# EAGLE design tlc (EAGLE 5.11)
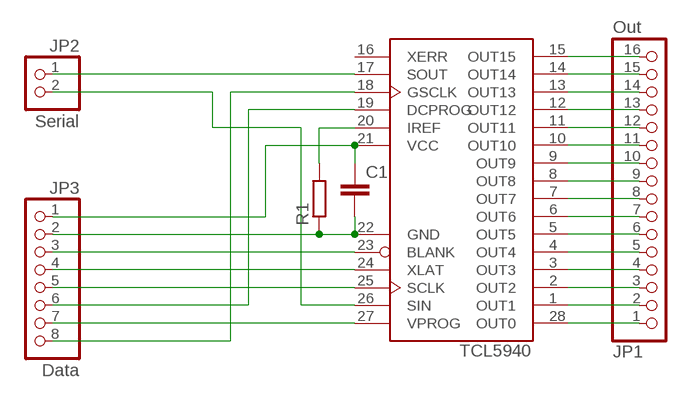
[diagram p0: schematic, sheet 1]

## Parts
C1  C-EU025-024X044  [C025-024X044]
IC1  TCL5940  [DIP28]
JP1  Out  PINHD-1X16  [1X16]
JP2  Serial  PINHD-1X2  [1X02]
JP3  Data  PINHD-1X8  [1X08]
R1  R-EU_0207/2V  [0207/2V]

## Nets
N$1: IC1.28(OUT0) JP1.1
N$2: IC1.1(OUT1) JP1.2
N$3: IC1.2(OUT2) JP1.3
N$4: IC1.3(OUT3) JP1.4
N$5: IC1.4(OUT4) JP1.5
N$6: IC1.5(OUT5) JP1.6
N$7: IC1.6(OUT6) JP1.7
N$8: IC1.7(OUT7) JP1.8
N$9: IC1.8(OUT8) JP1.9
N$10: IC1.9(OUT9) JP1.10
N$11: IC1.10(OUT10) JP1.11
N$12: IC1.11(OUT11) JP1.12
N$13: IC1.12(OUT12) JP1.13
N$14: IC1.13(OUT13) JP1.14
N$15: IC1.14(OUT14) JP1.15
N$16: IC1.15(OUT15) JP1.16
N$17: IC1.17(SOUT) JP2.1
N$18: IC1.26(SIN) JP2.2
N$19: C1.1 IC1.21(VCC) JP3.1
N$20: C1.2 IC1.22(GND) JP3.2 R1.1
N$21: IC1.23(BLANK) JP3.3
N$22: IC1.24(XLAT) JP3.4
N$23: IC1.25(SCLK) JP3.5
N$24: IC1.27(VPROG) JP3.7
N$25: IC1.18(GSCLK) JP3.8
N$26: IC1.19(DCPROG) JP3.6
N$27: IC1.20(IREF) R1.2
Unconnected: IC1.16(XERR)

## Library data of the parts
C1 = rcl:C-EU: CAPACITOR, European symbol
IC1 = tcl5940:TCL5940: 16-Channel 12-Bit LED Driver
JP1 = pinhead:PINHD-1X16: PIN HEADER
JP2 = pinhead:PINHD-1X2: PIN HEADER
JP3 = pinhead:PINHD-1X8: PIN HEADER
R1 = rcl:R-EU_: RESISTOR, European symbol

## Board
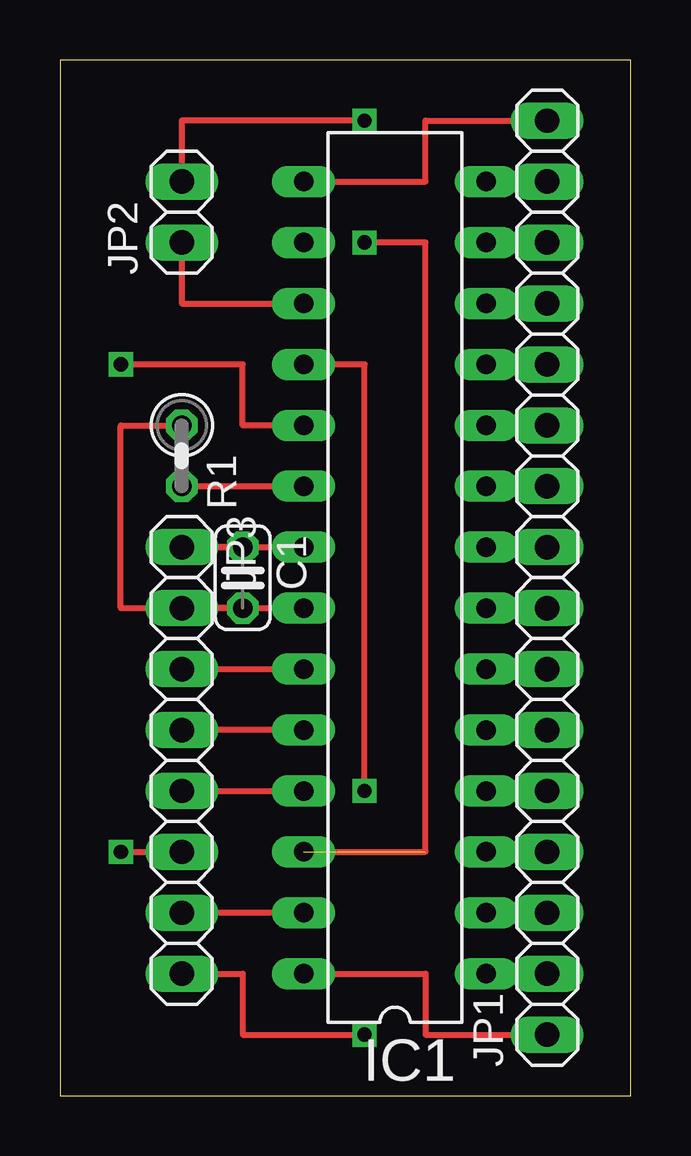
[diagram p1: board, top side]
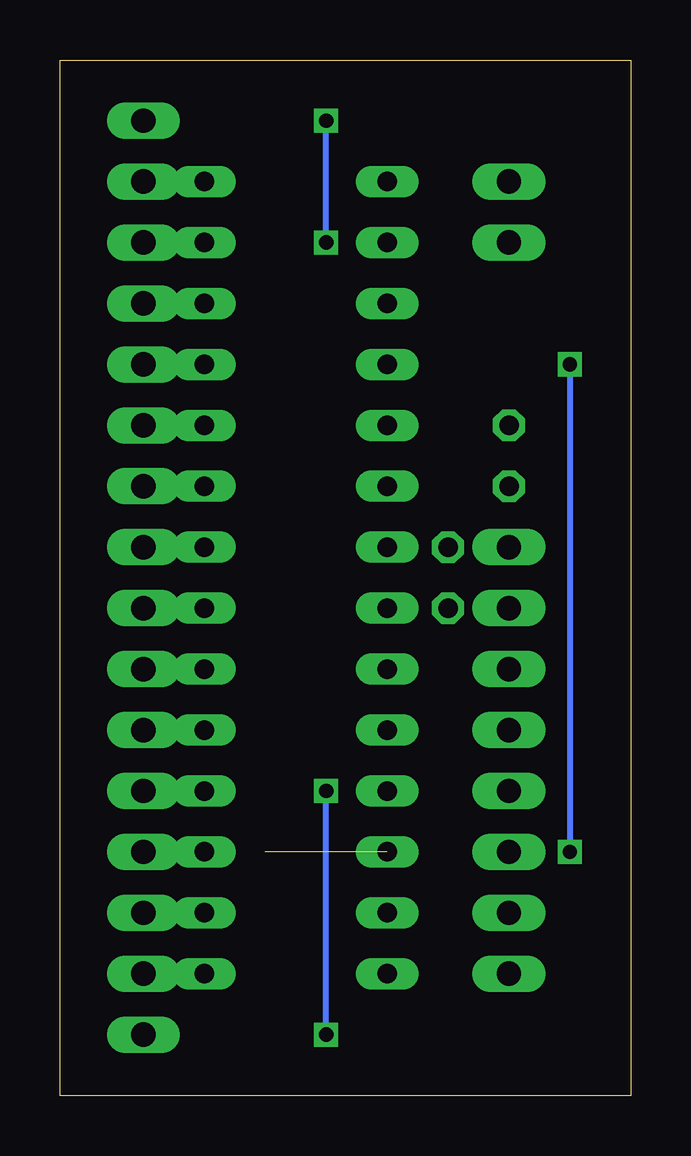
[diagram p2: board, bottom side, seen from below]

Size 23.8 x 43.17 mm. Coordinates in mm from the lower left corner, seen from the top.
Outline: 0,0 23.8,0 23.8,43.17 0,43.17 0,0
Copper layers (1*16): Top 0.035mm / dielectric 1.5mm / Bottom 0.035mm
Design rules "default": minimum track width 10mil, minimum drill 24mil, track to track 8mil, track to pad 8mil, pad to pad 8mil, via to via 8mil, smd to smd 8mil, copper to edge 40mil, drill to drill 8mil, minimum pad ring 10mil, minimum via ring 8mil, stop-mask expansion 4mil, vias tented up to drill 0mil, thermal gap 10mil

### Footprints (pad centres in the part's own frame; a part is rotated, then mirrored left to right if it is on the bottom)
C025-024X044 = drill 0.813 octagon: 1 -1.27,0; 2 1.27,0
DIP28 = drill 0.813 long: 1 -15.24,-3.81; 2 -12.7,-3.81; 3 -10.16,-3.81; 4 -7.62,-3.81; 5 -5.08,-3.81; 6 -2.54,-3.81; 7 0,-3.81; 8 2.54,-3.81; 9 5.08,-3.81; 10 7.62,-3.81; 11 10.16,-3.81; 12 12.7,-3.81; 13 15.24,-3.81; 14 17.78,-3.81; 15 17.78,3.81; 16 15.24,3.81; 17 12.7,3.81; 18 10.16,3.81; 19 7.62,3.81; 20 5.08,3.81; 21 2.54,3.81; 22 0,3.81; 23 -2.54,3.81; 24 -5.08,3.81; 25 -7.62,3.81; 26 -10.16,3.81; 27 -12.7,3.81; 28 -15.24,3.81
1X16 = drill 1.016 long: 1 -19.05,0; 2 -16.51,0; 3 -13.97,0; 4 -11.43,0; 5 -8.89,0; 6 -6.35,0; 7 -3.81,0; 8 -1.27,0; 9 1.27,0; 10 3.81,0; 11 6.35,0; 12 8.89,0; 13 11.43,0; 14 13.97,0; 15 16.51,0; 16 19.05,0
1X02 = drill 1.016 long: 1 -1.27,0; 2 1.27,0
1X08 = drill 1.016 long: 1 -8.89,0; 2 -6.35,0; 3 -3.81,0; 4 -1.27,0; 5 1.27,0; 6 3.81,0; 7 6.35,0; 8 8.89,0
0207/2V = drill 0.813 octagon: 1 -1.27,0; 2 1.27,0

### Placement (x,y rotation side)
C1  7.62,21.59 270 top
IC1  13.97,20.32 90 top
JP1  20.32,21.59 90 top
JP2  5.08,36.83 90 top
JP3  5.08,13.97 270 top
R1  5.08,26.67 270 top

### Tracks (layer width: path | path; a pad name or v marks a point on that pad's centre or on a via)
N$1
  Top 0.254: IC1.28 15.24,5.08 15.24,2.54 JP1.1
N$2
  Top 0.254: IC1.1 JP1.2
N$3
  Top 0.254: IC1.2 JP1.3
N$4
  Top 0.254: IC1.3 JP1.4
N$5
  Top 0.254: IC1.4 JP1.5
N$6
  Top 0.254: IC1.5 JP1.6
N$7
  Top 0.254: IC1.6 JP1.7
N$8
  Top 0.254: IC1.7 JP1.8
N$9
  Top 0.254: IC1.8 JP1.9
N$10
  Top 0.254: IC1.9 JP1.10
N$11
  Top 0.254: IC1.10 JP1.11
N$12
  Top 0.254: IC1.11 JP1.12
N$13
  Top 0.254: IC1.12 JP1.13
N$14
  Top 0.254: IC1.13 JP1.14
N$15
  Top 0.254: IC1.14 JP1.15
N$16
  Top 0.254: IC1.15 15.24,38.1 15.24,40.64 JP1.16
N$17
  Top 0.254: JP2.1 5.08,33.02 IC1.17
N$18  (via drill 0.6)  (1 unrouted)
  Top 0.254: v12.7,40.64 5.08,40.64 JP2.2 | v12.7,35.56 15.24,35.56 15.24,10.16 IC1.26
  Bottom 0.254: v12.7,35.56 v12.7,40.64
N$19
  Top 0.254: IC1.21 JP3.1 C1.1
N$20
  Top 0.254: IC1.22 JP3.2 C1.2 2.54,20.32 2.54,27.94 R1.1
N$21
  Top 0.254: JP3.3 IC1.23
N$22
  Top 0.254: IC1.24 JP3.4
N$23
  Top 0.254: JP3.5 IC1.25
N$24
  Top 0.254: IC1.27 JP3.7
N$25  (via drill 0.6)
  Top 0.254: JP3.8 7.62,5.08 7.62,2.54 v12.7,2.54 | v12.7,12.7 12.7,30.48 IC1.18
  Bottom 0.254: v12.7,2.54 v12.7,12.7
N$26  (via drill 0.6)
  Top 0.254: IC1.19 7.62,27.94 7.62,30.48 v2.54,30.48 | v2.54,10.16 JP3.6
  Bottom 0.254: v2.54,30.48 v2.54,10.16
N$27
  Top 0.254: R1.2 IC1.20